# Altium schematic sheet Sheet1.SchDoc
size A4
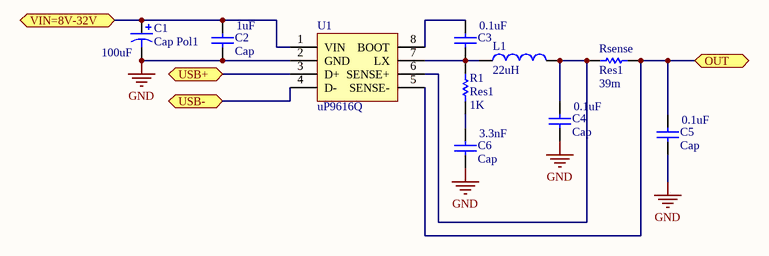
[diagram p0: Sheet1.SchDoc]

## Parts
C1  Cap Pol1  value 100uF  [RB7.6-15]
C2  Cap  value 1uF  [RAD-0.3]
C3  value 0.1uF  [RAD-0.3]  (hidden comment: Cap)
C4  Cap  value 0.1uF  [RAD-0.3]
C5  Cap  value 0.1uF  [RAD-0.3]
C6  Cap  value 3.3nF  [RAD-0.3]
L1  22uH
R1  Res1  value 1K  [AXIAL-0.3]
Rsense  Res1  value 39m  [AXIAL-0.3]
U1  uP9616Q

## Ports
OUT, USB+, USB-, VIN=8V-32V

## Nets
GND: C1.2 C2.1 C4.1 C5.1 C6.1 U1.2(GND)
OUT: C5.2 Rsense.2 U1.5(SENSE-) ; port OUT
USB+: U1.3(D+) ; port USB+
USB-: U1.4(D-) ; port USB-
VIN=8V-32V: C1.1 C2.2 U1.1(VIN) ; port VIN=8V-32V
NetC3_1: C3.1 L1.1 R1.2 U1.7(LX)
NetC3_2: C3.2 U1.8(BOOT)
NetC4_2: C4.2 L1.2 Rsense.1 U1.6(SENSE+)
NetC6_2: C6.2 R1.1

## Library data of the parts
C1 = Cap Pol1: Polarized Capacitor (Radial); Published: 8-Jun-2000; LatestRevisionDate: 17-Jul-2002; LatestRevisionNote: Re-released for DXP Platform.; PackageReference: RB7.6-15; Publisher: Altium Limited; PackageDescription: Polarized Capacitor (Radial); 2 Leads
C2-C6 = Cap: Capacitor; Published: 8-Jun-2000; LatestRevisionDate: 17-Jul-2002; LatestRevisionNote: Re-released for DXP Platform.; PackageReference: RAD-0.3; Publisher: Altium Limited; PackageDescription: Radial Cap, Thru-Hole; 2 Leads; 0.3 in Pin Spacing
L1 = L
R1 Rsense = Res1: Resistor; Published: 8-Jun-2000; LatestRevisionDate: 17-Jul-2002; LatestRevisionNote: Re-released for DXP Platform.; PackageReference: AXIAL-0.3; Publisher: Altium Limited; PackageDescription: Axial Device, Thru-Hole; 2 Leads; 0.3 in Pin Spacing
U1 = 6N137